# Altium project LAUNCHXL-CC1310.PrjPcb (part 3 of 4)
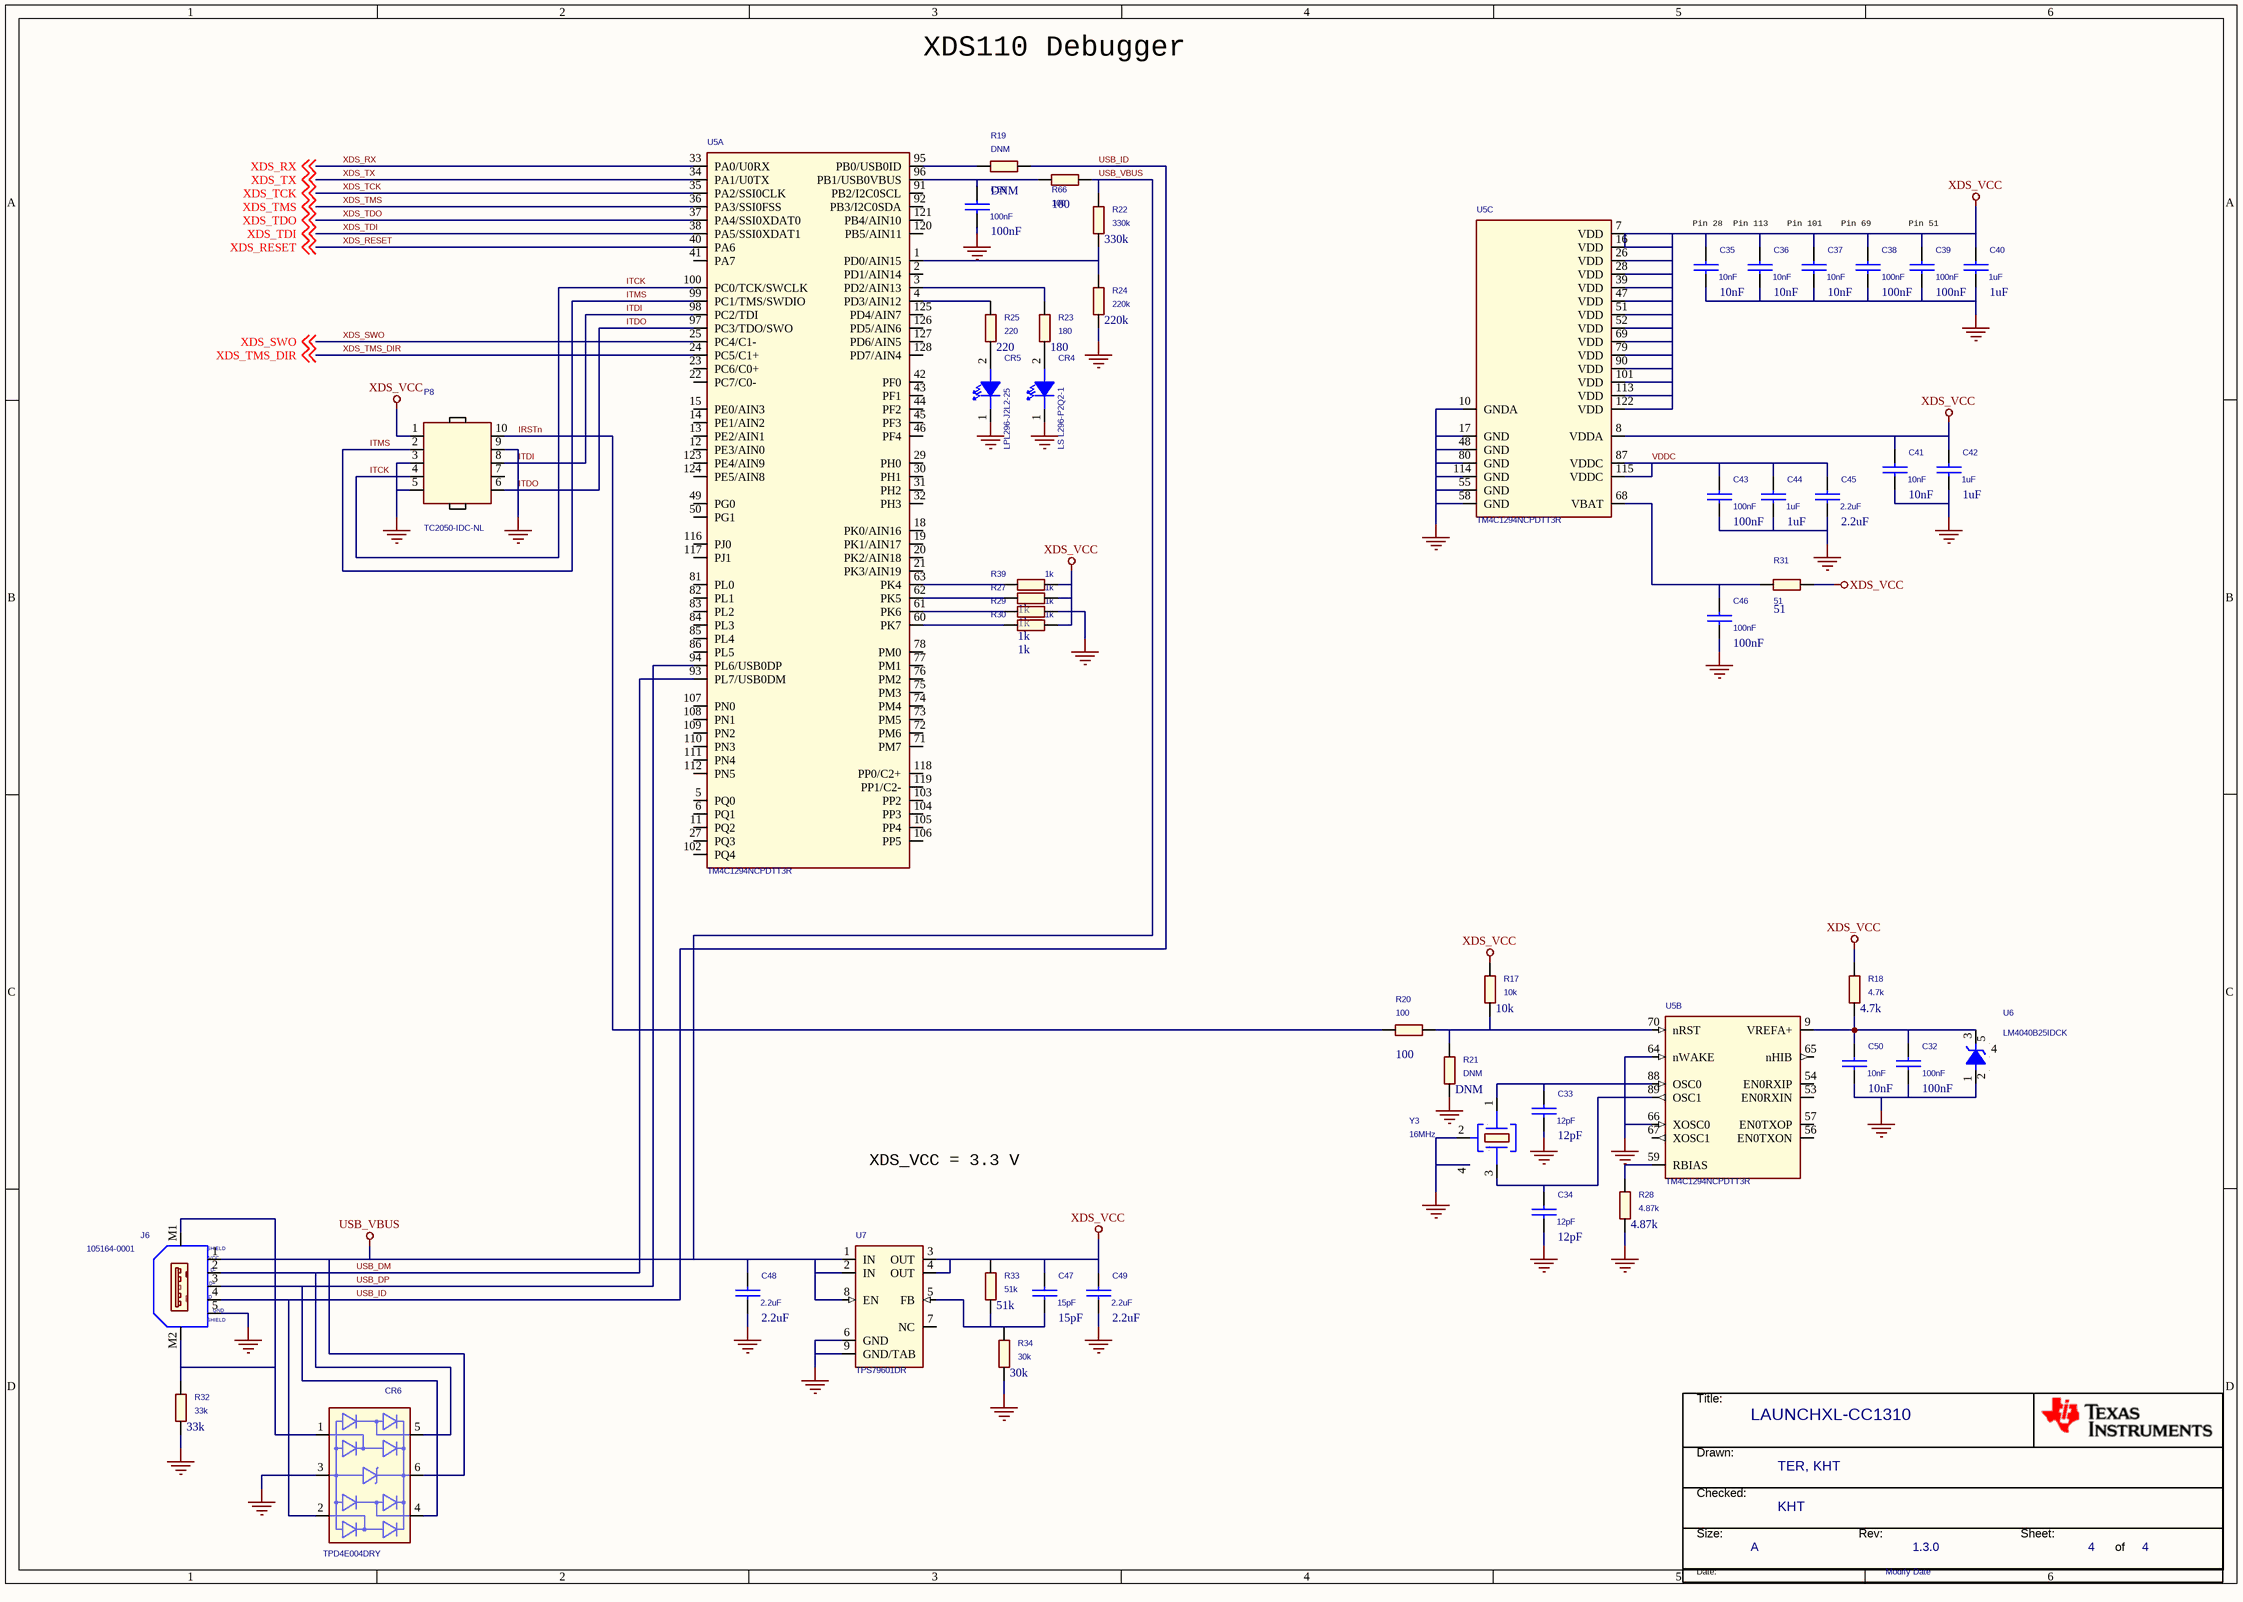
[diagram p4: 4_XDS110.SchDoc]

## Sheet 4_XDS110.SchDoc (continued)

### Library data of the parts
*#3 = TI_Norway_Title_Block_BMP: OrgName: Texas Instruments; Page Number: 4
C32 C38 C46 = CAPACITOR: CAPACITOR, CERAMIC X7R, 100nF, 6.3V, -10%/+10%, -55DEGC/+125DEGC, 0402, SMD; Vendor Part Status: NRND; Vendor Part Number: GRM155R70J104KA01D; MPN Status: ACTIVE; Part Number: 02-07610; VOLTAGE: CMAX; CURRENT: CIMAX; KNEE: CBMAX; PSpiceTemplate: C^@REFDES %1 %2 ?TOLERANCE|C^@REFDES| @VALUE ?IC/IC=@IC/ TC=@TC1,@TC2 ?TOLERANCE|\n.model C^@REFDES CAP C=1 DEV=@TOLERANCE%|; DIST: FLAT; SLOPE: CSMAX; MAX_TEMP: CTMAX; TC1: 0; Vendor: MURATA; BU Name: TEXAS INSTRUMENTS NORWAY; Packing Type: TAPE_&_REEL; Packing Size: 10000; Budget Currency: EUR; Budget Price: 0.007; Lead Time: 14; NOTE Status: PREFERRED; Min Tol: -10%; Max Tol: +10%; PCB Package: 0402; Old Footprint: CAPC1005X60N,0402; TC2: 0; Value: 100nF; Country of Origin: PHILIPPINES; Last Time Buy: N/A; AutoDoc File: https://notefied-dynamic-precision.com/DB/Apps/Desktop/Item/Object.aspx?id=113338; Datasheet URL 2: http://search.murata.co.jp/Ceramy/image/img/w_hinm/L0005E.pdf; Datasheet URL 1: http://psearch.murata.com/capacitor/product/GRM155R70J104KA01%23.pdf; WEIGHT: 0.0016g; LifeCycle Status: ACTIVE; RoHS Status: ROHS_COMPLIANT; MPN: GRM155R70J104KA01D; Manufacturer: MURATA; Dielectric Type: X7R; Capacitance: 100nF; Rtd Voltage: 6.3V; Min Oper Temp: -55DEGC; Max Oper Temp: +125DEGC; Part Type: CAPACITOR\CERAMIC\0402\STANDARD; Mounting Type: SMD; Revision: R000
C33 C34 = CAPACITOR: CAPACITOR, CERAMIC C0G/NP0, 12pF, 50V, -5%/+5%, -55DEGC/+125DEGC, 0402, SMD; Vendor Part Status: ACTIVE; Vendor Part Number: GRM1555C1H120JA01D; MPN: CAPACITOR_0402_12pF_C0G/NP0_M_+/-5%_50V; Manufacturer: MANUFACTURER SELECTION; Part Number: 02-07617; VOLTAGE: CMAX; CURRENT: CIMAX; KNEE: CBMAX; PSpiceTemplate: C^@REFDES %1 %2 ?TOLERANCE|C^@REFDES| @VALUE ?IC/IC=@IC/ TC=@TC1,@TC2 ?TOLERANCE|\n.model C^@REFDES CAP C=1 DEV=@TOLERANCE%|; DIST: FLAT; SLOPE: CSMAX; MAX_TEMP: CTMAX; TC1: 0; Vendor: MURATA; BU Name: TEXAS INSTRUMENTS NORWAY; Packing Type: TAPE_&_REEL; Packing Size: 10000; Definied Quality: INDUSTRIAL; Budget Currency: EUR; Budget Price: 0.007; Lead Time: 12; NOTE Status: PREFERRED; Min Tol: -5%; Max Tol: +5%; PCB Package: 0402; Old Footprint: CAPC1005X60N; TC2: 0; Value: 12pF; Country of Origin: PHILIPPINES; AutoDoc File: https://notefied-dynamic-precision.com/DB/Apps/Desktop/Item/Object.aspx?id=113345; Datasheet URL 2: http://search.murata.co.jp/Ceramy/image/img/w_hinm/L0005E.pdf; Datasheet URL 1: http://psearch.murata.com/capacitor/product/GRM1555C1H120JA01%23.pdf; MSL: N/A; MTBF Standard: N/A; MTBF: N/A; Esd Level: N/A; WEIGHT: 0.0016g; Last Time Buy: N/A; LifeCycle Status: ACTIVE; RoHS Status: ROHS_COMPLIANT; MPN Status: ACTIVE; Dielectric Type: C0G/NP0; Capacitance: 12pF; Rtd Voltage: 50V; Min Oper Temp: -55DEGC; Max Oper Temp: +125DEGC; Part Type: CAPACITOR\CERAMIC\0402\STANDARD; Mounting Type: SMD; Revision: R000
C35 C41 = CAPACITOR: CAPACITOR, CERAMIC X7R, 10nF, 25V, -10%/+10%, -55DEGC/+125DEGC, 0402, SMD; Vendor Part Status: ACTIVE; Vendor Part Number: CAPACITOR_0402_10nF_X7R_M_+/-10%_25V; Part Number: 02-07615; VOLTAGE: CMAX; CURRENT: CIMAX; KNEE: CBMAX; PSpiceTemplate: C^@REFDES %1 %2 ?TOLERANCE|C^@REFDES| @VALUE ?IC/IC=@IC/ TC=@TC1,@TC2 ?TOLERANCE|\n.model C^@REFDES CAP C=1 DEV=@TOLERANCE%|; DIST: FLAT; SLOPE: CSMAX; MAX_TEMP: CTMAX; TC1: 0; Vendor: MANUFACTURER SELECTION; BU Name: TEXAS INSTRUMENTS NORWAY; Packing Type: TAPE_&_REEL; Packing Size: 10000; Definied Quality: INDUSTRIAL; Budget Currency: USD; Budget Price: 0.00589; NOTE Status: PREFERRED; Min Tol: -10%; Max Tol: +10%; PCB Package: 0402; Old Footprint: CAPC1005X60N; TC2: 0; Value: 10nF; Country of Origin: MISSING INFO; AutoDoc File: https://notefied-dynamic-precision.com/DB/Apps/Desktop/Item/Object.aspx?id=113343; Datasheet URL 2: N/A; Datasheet URL 1: N/A; MSL: N/A; MTBF Standard: N/A; MTBF: N/A; Esd Level: N/A; WEIGHT: N/A; Last Time Buy: N/A; Lead Time: N/A; LifeCycle Status: ACTIVE; RoHS Status: ROHS_COMPLIANT; MPN Status: ACTIVE; MPN: CAPACITOR_0402_10nF_X7R_M_+/-10%_25V; Manufacturer: MANUFACTURER SELECTION; Dielectric Type: X7R; Capacitance: 10nF; Rtd Voltage: 25V; Min Oper Temp: -55DEGC; Max Oper Temp: +125DEGC; Part Type: CAPACITOR\CERAMIC\0402\STANDARD; Mounting Type: SMD; Revision: R000
C36 C37 C50 = CAPACITOR: CAPACITOR, CERAMIC X7R, 10nF, 25V, -10%/+10%, -55DEGC/+125DEGC, 0402, SMD; Vendor Part Status: ACTIVE; Vendor Part Number: CAPACITOR_0402_10nF_X7R_M_+/-10%_25V; Part Number: 02-07615; VOLTAGE: CMAX; CURRENT: CIMAX; KNEE: CBMAX; PSpiceTemplate: C^@REFDES %1 %2 ?TOLERANCE|C^@REFDES| @VALUE ?IC/IC=@IC/ TC=@TC1,@TC2 ?TOLERANCE|\n.model C^@REFDES CAP C=1 DEV=@TOLERANCE%|; DIST: FLAT; SLOPE: CSMAX; MAX_TEMP: CTMAX; TC1: 0; Vendor: MANUFACTURER SELECTION; BU Name: TEXAS INSTRUMENTS NORWAY; Old Footprint: CAPC1005X60N; PCB Package: 0402; Max Tol: +10%; Min Tol: -10%; NOTE Status: PREFERRED; Budget Price: 0.00589; Budget Currency: USD; Definied Quality: INDUSTRIAL; Packing Size: 10000; Packing Type: TAPE_&_REEL; TC2: 0; Value: 10nF; Country of Origin: MISSING INFO; Revision: R000; Mounting Type: SMD; Part Type: CAPACITOR\CERAMIC\0402\STANDARD; Max Oper Temp: +125DEGC; Min Oper Temp: -55DEGC; Rtd Voltage: 25V; Capacitance: 10nF; Dielectric Type: X7R; Manufacturer: MANUFACTURER SELECTION; MPN: CAPACITOR_0402_10nF_X7R_M_+/-10%_25V; MPN Status: ACTIVE; RoHS Status: ROHS_COMPLIANT; LifeCycle Status: ACTIVE; Lead Time: N/A; Last Time Buy: N/A; WEIGHT: N/A; Esd Level: N/A; MTBF: N/A; MTBF Standard: N/A; MSL: N/A; Datasheet URL 1: N/A; Datasheet URL 2: N/A; AutoDoc File: https://notefied-dynamic-precision.com/DB/Apps/Desktop/Item/Object.aspx?id=113343
C39 C43 = CAPACITOR: CAPACITOR, CERAMIC X7R, 100nF, 6.3V, -10%/+10%, -55DEGC/+125DEGC, 0402, SMD; Vendor Part Status: NRND; Vendor Part Number: GRM155R70J104KA01D; Part Number: 02-07610; MPN Status: ACTIVE; VOLTAGE: CMAX; CURRENT: CIMAX; KNEE: CBMAX; PSpiceTemplate: C^@REFDES %1 %2 ?TOLERANCE|C^@REFDES| @VALUE ?IC/IC=@IC/ TC=@TC1,@TC2 ?TOLERANCE|\n.model C^@REFDES CAP C=1 DEV=@TOLERANCE%|; DIST: FLAT; SLOPE: CSMAX; MAX_TEMP: CTMAX; TC1: 0; Vendor: MURATA; BU Name: TEXAS INSTRUMENTS NORWAY; Old Footprint: CAPC1005X60N,0402; PCB Package: 0402; Max Tol: +10%; Min Tol: -10%; NOTE Status: PREFERRED; Lead Time: 14; Budget Price: 0.007; Budget Currency: EUR; Packing Size: 10000; Packing Type: TAPE_&_REEL; TC2: 0; Value: 100nF; Country of Origin: PHILIPPINES; Last Time Buy: N/A; Revision: R000; Mounting Type: SMD; Part Type: CAPACITOR\CERAMIC\0402\STANDARD; Max Oper Temp: +125DEGC; Min Oper Temp: -55DEGC; Rtd Voltage: 6.3V; Capacitance: 100nF; Dielectric Type: X7R; Manufacturer: MURATA; MPN: GRM155R70J104KA01D; RoHS Status: ROHS_COMPLIANT; LifeCycle Status: ACTIVE; WEIGHT: 0.0016g; Datasheet URL 1: http://psearch.murata.com/capacitor/product/GRM155R70J104KA01%23.pdf; Datasheet URL 2: http://search.murata.co.jp/Ceramy/image/img/w_hinm/L0005E.pdf; AutoDoc File: https://notefied-dynamic-precision.com/DB/Apps/Desktop/Item/Object.aspx?id=113338
C40 C42 = CAPACITOR: CAPACITOR, CERAMIC X5R, 1uF, 10V, -10%/+10%, -55DEGC/+85DEGC, 0402, SMD; Vendor Part Status: NRND; Vendor Part Number: GRM155R61A105KE15D; Part Number: 02-07611; MPN Status: ACTIVE; VOLTAGE: CMAX; CURRENT: CIMAX; KNEE: CBMAX; PSpiceTemplate: C^@REFDES %1 %2 ?TOLERANCE|C^@REFDES| @VALUE ?IC/IC=@IC/ TC=@TC1,@TC2 ?TOLERANCE|\n.model C^@REFDES CAP C=1 DEV=@TOLERANCE%|; DIST: FLAT; SLOPE: CSMAX; MAX_TEMP: CTMAX; TC1: 0; Vendor: MURATA; BU Name: TEXAS INSTRUMENTS NORWAY; Old Footprint: CAPC1005X60N,0402; PCB Package: 0402; Max Tol: +10%; Min Tol: -10%; NOTE Status: PREFERRED; Lead Time: 12; Budget Price: 0.019; Budget Currency: EUR; Definied Quality: INDUSTRIAL; Packing Size: 10000; Packing Type: TAPE_&_REEL; TC2: 0; Value: 1uF; Country of Origin: PHILIPPINES,CHINA; Revision: R000; Mounting Type: SMD; Part Type: CAPACITOR\CERAMIC\0402\STANDARD; Max Oper Temp: +85DEGC; Min Oper Temp: -55DEGC; Rtd Voltage: 10V; Capacitance: 1uF; Dielectric Type: X5R; Manufacturer: MURATA; MPN: GRM155R61A105KE15D; RoHS Status: ROHS_COMPLIANT; Last Time Buy: N/A; WEIGHT: 0.0016g; Esd Level: N/A; MTBF: N/A; MTBF Standard: N/A; MSL: 1; Datasheet URL 1: http://psearch.murata.com/capacitor/product/GRM155R61A105KE15%23.pdf; Datasheet URL 2: http://search.murata.co.jp/Ceramy/image/img/w_hinm/L0005E.pdf; AutoDoc File: https://notefied-dynamic-precision.com/DB/Apps/Desktop/Item/Object.aspx?id=113339
C44 = CAPACITOR: CAPACITOR, CERAMIC X5R, 1uF, 10V, -10%/+10%, -55DEGC/+85DEGC, 0402, SMD; Vendor Part Status: NRND; Vendor Part Number: GRM155R61A105KE15D; MPN Status: ACTIVE; Part Number: 02-07611; VOLTAGE: CMAX; CURRENT: CIMAX; KNEE: CBMAX; PSpiceTemplate: C^@REFDES %1 %2 ?TOLERANCE|C^@REFDES| @VALUE ?IC/IC=@IC/ TC=@TC1,@TC2 ?TOLERANCE|\n.model C^@REFDES CAP C=1 DEV=@TOLERANCE%|; DIST: FLAT; SLOPE: CSMAX; MAX_TEMP: CTMAX; TC1: 0; Vendor: MURATA; BU Name: TEXAS INSTRUMENTS NORWAY; Packing Type: TAPE_&_REEL; Packing Size: 10000; Definied Quality: INDUSTRIAL; Budget Currency: EUR; Budget Price: 0.019; Lead Time: 12; NOTE Status: PREFERRED; Min Tol: -10%; Max Tol: +10%; PCB Package: 0402; Old Footprint: CAPC1005X60N,0402; TC2: 0; Value: 1uF; Country of Origin: PHILIPPINES,CHINA; AutoDoc File: https://notefied-dynamic-precision.com/DB/Apps/Desktop/Item/Object.aspx?id=113339; Datasheet URL 2: http://search.murata.co.jp/Ceramy/image/img/w_hinm/L0005E.pdf; Datasheet URL 1: http://psearch.murata.com/capacitor/product/GRM155R61A105KE15%23.pdf; MSL: 1; MTBF Standard: N/A; MTBF: N/A; Esd Level: N/A; WEIGHT: 0.0016g; Last Time Buy: N/A; RoHS Status: ROHS_COMPLIANT; MPN: GRM155R61A105KE15D; Manufacturer: MURATA; Dielectric Type: X5R; Capacitance: 1uF; Rtd Voltage: 10V; Min Oper Temp: -55DEGC; Max Oper Temp: +85DEGC; Part Type: CAPACITOR\CERAMIC\0402\STANDARD; Mounting Type: SMD; Revision: R000
C45 C48 = CAPACITOR: CAPACITOR, CERAMIC X5R, 2.2uF, 6.3V, -10%/+10%, -55DEGC/+85DEGC, 0402, SMD; Vendor Part Status: NRND; Vendor Part Number: GRM155R60J225KE95D; Part Number: 02-07624; VOLTAGE: CMAX; CURRENT: CIMAX; KNEE: CBMAX; PSpiceTemplate: C^@REFDES %1 %2 ?TOLERANCE|C^@REFDES| @VALUE ?IC/IC=@IC/ TC=@TC1,@TC2 ?TOLERANCE|\n.model C^@REFDES CAP C=1 DEV=@TOLERANCE%|; DIST: FLAT; SLOPE: CSMAX; MAX_TEMP: CTMAX; TC1: 0; Vendor: MURATA; BU Name: TEXAS INSTRUMENTS NORWAY; Old Footprint: CAPC1005X60N; PCB Package: 0402; Max Tol: +10%; Min Tol: -10%; NOTE Status: PREFERRED; Budget Price: 0.0126; Budget Currency: USD; Definied Quality: INDUSTRIAL; Packing Size: 10000; Packing Type: TAPE_&_REEL; TC2: 0; Value: 2.2uF; Country of Origin: PHILIPPINES; LifeCycle Status: NRND; Revision: R000; Mounting Type: SMD; Part Type: CAPACITOR\CERAMIC\0402\STANDARD; Max Oper Temp: +85DEGC; Min Oper Temp: -55DEGC; Rtd Voltage: 6.3V; Capacitance: 2.2uF; Dielectric Type: X5R; Manufacturer: MURATA; MPN: GRM155R60J225KE95D; MPN Status: NRND; RoHS Status: ROHS_COMPLIANT; Lead Time: N/A; Last Time Buy: N/A; WEIGHT: 0.0016g; Esd Level: N/A; MTBF: N/A; MTBF Standard: N/A; MSL: 1; Datasheet URL 1: http://psearch.murata.com/capacitor/product/GRM155R60J225KE95%23.pdf; Datasheet URL 2: http://search.murata.co.jp/Ceramy/image/img/w_hinm/L0005E.pdf; AutoDoc File: https://notefied-dynamic-precision.com/DB/Apps/Desktop/Item/Object.aspx?id=113352
C47 = CAPACITOR: CAPACITOR, CERAMIC C0G/NP0, 15pF, 50V, -5%/+5%, -55DEGC/+125DEGC, 0402, SMD; Vendor Part Status: ACTIVE; Vendor Part Number: CAPACITOR_0402_15pF_C0G/NP0_M_+/-5%_50V; Part Number: 02-07613; VOLTAGE: CMAX; CURRENT: CIMAX; KNEE: CBMAX; PSpiceTemplate: C^@REFDES %1 %2 ?TOLERANCE|C^@REFDES| @VALUE ?IC/IC=@IC/ TC=@TC1,@TC2 ?TOLERANCE|\n.model C^@REFDES CAP C=1 DEV=@TOLERANCE%|; DIST: FLAT; SLOPE: CSMAX; MAX_TEMP: CTMAX; TC1: 0; Vendor: MANUFACTURER SELECTION; BU Name: TEXAS INSTRUMENTS NORWAY; Packing Type: TAPE_&_REEL; Packing Size: 10000; Definied Quality: INDUSTRIAL; Budget Currency: USD; Budget Price: 0.00589; NOTE Status: PREFERRED; Min Tol: -5%; Max Tol: +5%; PCB Package: 0402; Old Footprint: CAPC1005X60N; TC2: 0; Value: 15pF; Country of Origin: MISSING INFO; AutoDoc File: https://notefied-dynamic-precision.com/DB/Apps/Desktop/Item/Object.aspx?id=113341; Datasheet URL 2: N/A; Datasheet URL 1: N/A; MSL: N/A; MTBF Standard: N/A; MTBF: N/A; Esd Level: N/A; WEIGHT: N/A; Last Time Buy: N/A; Lead Time: N/A; LifeCycle Status: ACTIVE; RoHS Status: ROHS_COMPLIANT; MPN Status: ACTIVE; MPN: CAPACITOR_0402_15pF_C0G/NP0_M_+/-5%_50V; Manufacturer: MANUFACTURER SELECTION; Dielectric Type: C0G/NP0; Capacitance: 15pF; Rtd Voltage: 50V; Min Oper Temp: -55DEGC; Max Oper Temp: +125DEGC; Part Type: CAPACITOR\CERAMIC\0402\STANDARD; Mounting Type: SMD; Revision: R000
C49 = CAPACITOR: CAPACITOR, CERAMIC X5R, 2.2uF, 6.3V, -10%/+10%, -55DEGC/+85DEGC, 0402, SMD; Vendor Part Status: NRND; Vendor Part Number: GRM155R60J225KE95D; Part Number: 02-07624; VOLTAGE: CMAX; CURRENT: CIMAX; KNEE: CBMAX; PSpiceTemplate: C^@REFDES %1 %2 ?TOLERANCE|C^@REFDES| @VALUE ?IC/IC=@IC/ TC=@TC1,@TC2 ?TOLERANCE|\n.model C^@REFDES CAP C=1 DEV=@TOLERANCE%|; DIST: FLAT; SLOPE: CSMAX; MAX_TEMP: CTMAX; TC1: 0; Vendor: MURATA; BU Name: TEXAS INSTRUMENTS NORWAY; Packing Type: TAPE_&_REEL; Packing Size: 10000; Definied Quality: INDUSTRIAL; Budget Currency: USD; Budget Price: 0.0126; NOTE Status: PREFERRED; Min Tol: -10%; Max Tol: +10%; PCB Package: 0402; Old Footprint: CAPC1005X60N; TC2: 0; Value: 2.2uF; Country of Origin: PHILIPPINES; LifeCycle Status: NRND; AutoDoc File: https://notefied-dynamic-precision.com/DB/Apps/Desktop/Item/Object.aspx?id=113352; Datasheet URL 2: http://search.murata.co.jp/Ceramy/image/img/w_hinm/L0005E.pdf; Datasheet URL 1: http://psearch.murata.com/capacitor/product/GRM155R60J225KE95%23.pdf; MSL: 1; MTBF Standard: N/A; MTBF: N/A; Esd Level: N/A; WEIGHT: 0.0016g; Last Time Buy: N/A; Lead Time: N/A; RoHS Status: ROHS_COMPLIANT; MPN Status: NRND; MPN: GRM155R60J225KE95D; Manufacturer: MURATA; Dielectric Type: X5R; Capacitance: 2.2uF; Rtd Voltage: 6.3V; Min Oper Temp: -55DEGC; Max Oper Temp: +85DEGC; Part Type: CAPACITOR\CERAMIC\0402\STANDARD; Mounting Type: SMD; Revision: R000
C59 = CAPACITOR: CAPACITOR, CERAMIC X7R, 100nF, 10V, -10%/+10%, -55DEGC/+125DEGC, 0402, SMD; Vendor Part Status: ACTIVE; Vendor Part Number: CAPACITOR_0402_100nF_X7R_M_+/-10%_10V; Part Number: 02-07614; MPN: CAPACITOR_0402_10nF_X7R_M_+/-10%_25V; VOLTAGE: CMAX; CURRENT: CIMAX; KNEE: CBMAX; PSpiceTemplate: C^@REFDES %1 %2 ?TOLERANCE|C^@REFDES| @VALUE ?IC/IC=@IC/ TC=@TC1,@TC2 ?TOLERANCE|\n.model C^@REFDES CAP C=1 DEV=@TOLERANCE%|; DIST: FLAT; SLOPE: CSMAX; MAX_TEMP: CTMAX; TC1: 0; Vendor: MANUFACTURER SELECTION; BU Name: TEXAS INSTRUMENTS NORWAY; Old Footprint: CAPC1005X60N; PCB Package: 0402; Max Tol: +10%; Min Tol: -10%; NOTE Status: PREFERRED; Budget Price: 0.00589; Budget Currency: USD; Definied Quality: INDUSTRIAL; Packing Size: 10000; Packing Type: TAPE_&_REEL; TC2: 0; Value: 100nF; Country of Origin: MISSING INFO; Revision: R000; Mounting Type: SMD; Part Type: CAPACITOR\CERAMIC\0402\STANDARD; Max Oper Temp: +125DEGC; Min Oper Temp: -55DEGC; Rtd Voltage: 10V; Capacitance: 100nF; Dielectric Type: X7R; Manufacturer: MANUFACTURER SELECTION; MPN Status: ACTIVE; RoHS Status: ROHS_COMPLIANT; LifeCycle Status: ACTIVE; Lead Time: N/A; Last Time Buy: N/A; WEIGHT: N/A; Esd Level: N/A; MTBF: N/A; MTBF Standard: N/A; MSL: N/A; Datasheet URL 1: N/A; Datasheet URL 2: N/A; AutoDoc File: https://notefied-dynamic-precision.com/DB/Apps/Desktop/Item/Object.aspx?id=113342
CR4 = LED: OPTO, LED, SUPER RED COLOR, 630nm, 1.8V TO 2.3V, 0.06A, 0603, SMD; MPN Status: NRND; Manufacturer: OSRAM; Part Number: 15-01169; PPCB Recomendation: Inactive for new design [Alert:0001]; Esd Level: HBM 2kV; Packing Type: TAPE_&_REEL; Packing Size: 5000; Definied Quality: INDUSTRIAL; Budget Currency: USD; Budget Price: 0.089; Lead Time: 8; NOTE Status: PREFERRED; Min Oper Temp: -40DEGC; Max Oper Temp: +100DEGC; PCB Package: 0603; Old Footprint: LEDC1708X67N; ALT_SYMBOLS: LEDC1708X67L,LEDC1708X67M; FPLIST: LEDC1708X67N,LEDC1708X67L,LEDC1708X67M; AutoDoc File: http://notefied-dynamic-precision.com/DB/Apps/Desktop/Item/Object.aspx?id=88355; Datasheet URL 2: http://www.osram-os.com/Graphics/XPic5/00077119_0.pdf/LS%20L296%20-%20SMARTLED%200603.pdf; Datasheet URL 1: http://www.osram-os.com/osram_os/en/products/product-catalog/led-light-emitting-diodes/smartled-0603/ls-l296/index.jsp?search_result=%2fosram_os%2fen%2fsearch%2fadvanced_search.jsp%3faction%3ddosearch%26inp_searchterm_1%3dLS%2bL296-P2Q2-1%26website_name%3; MSL: 2; MTBF Standard: N/A; MTBF: N/A; WEIGHT: 0.002g; Last Time Buy: N/A; RoHS Status: ROHS_COMPLIANT; MPN: LS L296-P2Q2-1; Rtd Current: 0.06A; Rtd Voltage: 1.8V TO 2.3V; Part Type: OPTO\LED\0603; Mounting Type: SMD; Revision: R003
CR5 = LED: OPTO, LED, GREEN COLOR, 562nm, 0.02A, 0.08W, 0603, SMD; MPN Status: NRND; Manufacturer: OSRAM; Part Number: 15-01023; Esd Level: HBM 2kV; Packing Type: TAPE_&_REEL; Packing Size: 5000; Definied Quality: INDUSTRIAL; Budget Currency: USD; Budget Price: 0.1263; Lead Time: 8; NOTE Status: NOT_PREFERRED; Rtd Voltage: 2V; Min Oper Temp: -40DEGC; Max Oper Temp: +100DEGC; PCB Package: 0603; Old Footprint: LEDC1707X65N; ALT_SYMBOLS: LEDC1707X65L,LEDC1707X65M; FPLIST: LEDC1707X65N,LEDC1707X65L,LEDC1707X65M; AutoDoc File: http://notefied-dynamic-precision.com/DB/Apps/Desktop/Item/Object.aspx?id=81622; Datasheet URL 2: http://catalog.osram-os.com/jsp/download.jsp?rootPath=/media/&name=LP_L296.pdf&docPath=Graphics/00077128_0.pdf&url=/media//_en/Graphics/00077128_0.pdf; Datasheet URL 1: N/A; MSL: 2; MTBF Standard: N/A; MTBF: N/A; WEIGHT: 0.002g; Last Time Buy: N/A; RoHS Status: ROHS_COMPLIANT; MPN: LP L296-J2L2-25; Rtd Power: 0.08W; Rtd Current: 0.02A; Part Type: OPTO\LED\0603; Mounting Type: SMD; Revision: R003
CR6 = DIODE_TPD4E004_SON6: DIODE, PROTECTION, ESD ARRAY, 4 CHANNEL, 6V TO 8V, -40DEGC/+85DEGC, SON6, SMD; MPN Status: ACTIVE; MPN: TPD4E004DRYR; Manufacturer: TEXAS INSTRUMENTS; Part Number: 14-06172; Designed_By: Piotr Przystup; MTBF Standard: CL=60%,Ta=55degC,Tt=125degC,Ea=0.7eV; MTBF: 9.90*10^8; Esd Level: HBM 15kV; Packing Type: TAPE_&_REEL; Packing Size: 5000; Definied Quality: INDUSTRIAL; Budget Currency: USD; Budget Price: 0.22; Lead Time: 10; NOTE Status: PREFERRED; Rtd Voltage: 6V TO 8V; Old Footprint: SON50P100X145X60-6N,SON50P100X145X65-6N; ALT_SYMBOLS: SON50P100X145X65-6L,SON50P100X145X65-6M; FPLIST: SON50P100X145X60-6N,SON50P100X145X65-6N,SON50P100X145X65-6L,SON50P100X145X65-6M; Designed_Date: 2014-05-13; AutoDoc File: http://notefied-dynamic-precision.com/DB/Apps/Desktop/Item/Object.aspx?id=96191; Datasheet URL 2: http://www.ti.com/lit/ds/symlink/tpd4e004.pdf; Datasheet URL 1: http://www.ti.com/lit/ml/mpds221e/mpds221e.pdf; MSL: 1; WEIGHT: 0.0028462g; Last Time Buy: N/A; RoHS Status: ROHS_COMPLIANT; Min Oper Temp: -40DEGC; Max Oper Temp: +85DEGC; Part Type: DIODE\PROTECTION; Mounting Type: SMD; PCB Package: SON6; Revision: R002
J6 = CONN_USB_MICRO_B_2MH: CONNECTOR, USB, FEMALE, RIGHT ANGLE, 1 ROW, 5 PINS, PITCH 0.65mm, SMD; MPN Status: ACTIVE; Manufacturer: MOLEX; Part Number: 06-04998; Designed_By: Artur Bielinski; CLASS: IO; Packing Type: TAPE_&_REEL; NOTE Status: PREFERRED; No Of Rows: 1; No Of Pos: 5; Rtd Current: 1.8V; Rtd Voltage: 30V; Min Oper Temp: -30DEGC; Max Oper Temp: +85DEGC; ALT_SYMBOLS: MOLEX_1051640001_A2L,MOLEX_1051640001_A2M; FPLIST: MOLEX_1051640001_A2N,MOLEX_1051640001_A2L,MOLEX_1051640001_A2M; Design_Date: 2015-03-31; AutoDoc File: http://notefied-dynamic-precision.com/DB/Apps/Desktop/Item/Object.aspx?id=104390; Datasheet URL 2: http://www.molex.com/webdocs/datasheets/pdf/en-us/1051640001_IO_CONNECTORS.pdf; Datasheet URL 1: http://www.molex.com/pdm_docs/sd/1051640001_sd.pdf; WEIGHT: 0.234g; RoHS Status: ROHS_COMPLIANT; MPN: 105164-0001; Pitch: 0.65mm; Part Type: CONNECTOR\USB\MICRO_USB-B; Mounting Type: SMD; Old Footprint: MOLEX_1051640001_A2N; Revision: R001
P8 = CONN_IDC_TC2050-IDC-NL: NON COMPONENT, CONNECTOR CABLE, PLUG OF NAILS, 10 PINS, 2 ROWS, SMD; Part Number: 19-00452; FPLIST: TAGCONNECT_TC2050IDCNLN,TAGCONNECT_TC2050IDCNLL,TAGCONNECT_TC2050IDCNLM; ALT_SYMBOLS: TAGCONNECT_TC2050IDCNLL,TAGCONNECT_TC2050IDCNLM; Revision: R001; Old Footprint: TAGCONNECT_TC2050IDCNLN; Part Type: NON_COMPONENT\CONNECTOR; AutoDoc File: http://notefied-dynamic-precision.com/DB/Apps/Desktop/Item/Object.aspx?id=96644
R17 = RESISTOR: RESISTOR, THICK FILM, 10k, -5%/+5%, 0.063W, 50V, -55DEGC/+155DEGC, 0402, SMD; Vendor Part Status: ACTIVE; Vendor Part Number: RESISTOR_0402_10k_+/-5%_50V_0.063W_M_+/-200ppm; Part Number: 01-22353; PSpiceTemplate: R^@REFDES %1 %2 ?TOLERANCE|R^@REFDES| @VALUE TC=@TC1,@TC2 ?TOLERANCE|\n.model R^@REFDES RES R=1 DEV=@TOLERANCE%|; VOLTAGE: RVMAX; DIST: FLAT; MAX_TEMP: RTMAX; TC1: 0; POWER: RMAX; Vendor: MANUFACTURER SELECTION; BU Name: TEXAS INSTRUMENTS NORWAY; Packing Type: TAPE_&_REEL; Packing Size: 10000; Definied Quality: INDUSTRIAL; Budget Currency: USD; Budget Price: 0.00244; NOTE Status: PREFERRED; Min TC: -200PPM/DEGC; Max TC: +200PPM/DEGC; Min Tol: -5%; Max Tol: +5%; PCB Package: 0402; Old Footprint: RESC1005X40N; TC2: 0; Value: 10k; Country of Origin: MISSING INFO; AutoDoc File: https://notefied-dynamic-precision.com/DB/Apps/Desktop/Item/Object.aspx?id=113326; Datasheet URL 2: N/A; Datasheet URL 1: N/A; MSL: N/A; MTBF Standard: N/A; MTBF: N/A; Esd Level: N/A; WEIGHT: N/A; Last Time Buy: N/A; Lead Time: N/A; LifeCycle Status: ACTIVE; RoHS Status: ROHS_COMPLIANT; MPN Status: ACTIVE; MPN: RESISTOR_0402_10k_+/-5%_50V_0.063W_M_+/-200ppm; Manufacturer: MANUFACTURER SELECTION; Resistor Type: THICK FILM; Resistance: 10k; Rtd Power: 0.063W; Rtd Current: N/A; Rtd Voltage: 50V; Min Oper Temp: -55DEGC; Max Oper Temp: +155DEGC; Part Type: RESISTOR\0402\STANDARD; Mounting Type: SMD; Revision: R000
R18 = RESISTOR: RESISTOR, THICK FILM, 4.7k, -5%/+5%, 0.063W, 50V, -55DEGC/+155DEGC, 0402, SMD; Vendor Part Status: ACTIVE; Vendor Part Number: RESISTOR_0402_4.7k_+/-5%_50V_0.063W_M_+/-200ppm; Part Number: 01-22352; PSpiceTemplate: R^@REFDES %1 %2 ?TOLERANCE|R^@REFDES| @VALUE TC=@TC1,@TC2 ?TOLERANCE|\n.model R^@REFDES RES R=1 DEV=@TOLERANCE%|; VOLTAGE: RVMAX; DIST: FLAT; MAX_TEMP: RTMAX; TC1: 0; POWER: RMAX; Vendor: MANUFACTURER SELECTION; BU Name: TEXAS INSTRUMENTS NORWAY; Old Footprint: RESC1005X40N; PCB Package: 0402; Max Tol: +5%; Min Tol: -5%; Max TC: +200PPM/DEGC; Min TC: -200PPM/DEGC; NOTE Status: PREFERRED; Budget Price: 0.00244; Budget Currency: USD; Definied Quality: INDUSTRIAL; Packing Size: 10000; Packing Type: TAPE_&_REEL; TC2: 0; Value: 4.7k; Country of Origin: MISSING INFO; Revision: R000; Mounting Type: SMD; Part Type: RESISTOR\0402\STANDARD; Max Oper Temp: +155DEGC; Min Oper Temp: -55DEGC; Rtd Voltage: 50V; Rtd Current: N/A; Rtd Power: 0.063W; Resistance: 4.7k; Resistor Type: THICK FILM; Manufacturer: MANUFACTURER SELECTION; MPN: RESISTOR_0402_4.7k_+/-5%_50V_0.063W_M_+/-200ppm; MPN Status: ACTIVE; RoHS Status: ROHS_COMPLIANT; LifeCycle Status: ACTIVE; Lead Time: N/A; Last Time Buy: N/A; WEIGHT: N/A; Esd Level: N/A; MTBF: N/A; MTBF Standard: N/A; MSL: N/A; Datasheet URL 1: N/A; Datasheet URL 2: N/A; AutoDoc File: https://notefied-dynamic-precision.com/DB/Apps/Desktop/Item/Object.aspx?id=113325
R19 R21 = RESISTOR: RESISTOR, DO NOT MOUNT, 0402, SMD; Vendor Part Status: ACTIVE; Part Number: 01-22339; PSpiceTemplate: R^@REFDES %1 %2 ?TOLERANCE|R^@REFDES| @VALUE TC=@TC1,@TC2 ?TOLERANCE|\n.model R^@REFDES RES R=1 DEV=@TOLERANCE%|; VOLTAGE: RVMAX; DIST: FLAT; MAX_TEMP: RTMAX; TC1: 0; POWER: RMAX; BU Name: TEXAS INSTRUMENTS NORWAY; NOTE Status: PREFERRED; PCB Package: 0402; Old Footprint: RESC1005X40N,0402; TC2: 0; Value: DNM; Country of Origin: MISSING INFO; Vendor Part Number: DNM; Vendor: DO NOT MOUNT; AutoDoc File: https://notefied-dynamic-precision.com/DB/Apps/Desktop/Item/Object.aspx?id=113312; Datasheet URL 2: N/A; Datasheet URL 1: N/A; MSL: N/A; MTBF Standard: N/A; MTBF: N/A; Esd Level: N/A; WEIGHT: N/A; Packing Size: N/A; Last Time Buy: N/A; Budget Currency: N/A; Budget Price: N/A; Lead Time: N/A; LifeCycle Status: ACTIVE; RoHS Status: MISSING_INFO; MPN Status: ACTIVE; MPN: DNM; Manufacturer: DO NOT MOUNT; Resistor Type: THICK FILM; Resistance: N/A; Rtd Power: N/A; Rtd Current: N/A; Rtd Voltage: N/A; Min TC: N/A; Max TC: N/A; Min Tol: N/A; Max Tol: N/A; Min Oper Temp: N/A; Max Oper Temp: N/A; Part Type: RESISTOR\0402\STANDARD; Mounting Type: SMD; Revision: R000
R20 = RESISTOR: RESISTOR, THICK FILM, 100, -1%/+1%, 0.063W, 50V, -55DEGC/+155DEGC, 0402, SMD; Vendor Part Status: ACTIVE; Vendor Part Number: RESISTOR_0402_100_+/-1%_50V_0.063W_M_+/-100ppm; Part Number: 01-22357; PSpiceTemplate: R^@REFDES %1 %2 ?TOLERANCE|R^@REFDES| @VALUE TC=@TC1,@TC2 ?TOLERANCE|\n.model R^@REFDES RES R=1 DEV=@TOLERANCE%|; VOLTAGE: RVMAX; DIST: FLAT; MAX_TEMP: RTMAX; TC1: 0; POWER: RMAX; Vendor: MANUFACTURER SELECTION; BU Name: TEXAS INSTRUMENTS NORWAY; Old Footprint: RESC1005X40N; PCB Package: 0402; Max Tol: +1%; Min Tol: -1%; Max TC: +100PPM/DEGC; Min TC: -100PPM/DEGC; NOTE Status: PREFERRED; Budget Price: 0.00244; Budget Currency: USD; Definied Quality: INDUSTRIAL; Packing Size: 10000; Packing Type: TAPE_&_REEL; TC2: 0; Value: 100; Country of Origin: MISSING INFO; Rtd Current: N/A; Revision: R000; Mounting Type: SMD; Part Type: RESISTOR\0402\PRECISION; Max Oper Temp: +155DEGC; Min Oper Temp: -55DEGC; Rtd Voltage: 50V; Rtd Power: 0.063W; Resistance: 100; Resistor Type: THICK FILM; Manufacturer: MANUFACTURER SELECTION; MPN: RESISTOR_0402_100_+/-1%_50V_0.063W_M_+/-100ppm; MPN Status: ACTIVE; RoHS Status: ROHS_COMPLIANT; LifeCycle Status: ACTIVE; Lead Time: N/A; Last Time Buy: N/A; WEIGHT: N/A; Esd Level: N/A; MTBF: N/A; MTBF Standard: N/A; MSL: N/A; Datasheet URL 1: N/A; Datasheet URL 2: N/A; AutoDoc File: https://notefied-dynamic-precision.com/DB/Apps/Desktop/Item/Object.aspx?id=113330
R22 = RESISTOR: RESISTOR, THICK FILM, 330k, -1%/+1%, 0.063W, 50V, -55DEGC/+155DEGC, 0402, SMD; Vendor Part Status: ACTIVE; Vendor Part Number: RESISTOR_0402_330k_+/-1%_50V_0.063W_M_+/-100ppm; Part Number: 01-22362; PSpiceTemplate: R^@REFDES %1 %2 ?TOLERANCE|R^@REFDES| @VALUE TC=@TC1,@TC2 ?TOLERANCE|\n.model R^@REFDES RES R=1 DEV=@TOLERANCE%|; VOLTAGE: RVMAX; DIST: FLAT; MAX_TEMP: RTMAX; TC1: 0; POWER: RMAX; Vendor: MANUFACTURER SELECTION; BU Name: TEXAS INSTRUMENTS NORWAY; Old Footprint: RESC1005X40N; PCB Package: 0402; Max Tol: +1%; Min Tol: -1%; Max TC: +100PPM/DEGC; Min TC: -100PPM/DEGC; NOTE Status: PREFERRED; Budget Price: 0.00244; Budget Currency: USD; Definied Quality: INDUSTRIAL; Packing Size: 10000; Packing Type: TAPE_&_REEL; TC2: 0; Value: 330k; Country of Origin: MISSING INFO; Revision: R000; Mounting Type: SMD; Part Type: RESISTOR\0402\PRECISION; Max Oper Temp: +155DEGC; Min Oper Temp: -55DEGC; Rtd Voltage: 50V; Rtd Power: 0.063W; Resistance: 330k; Resistor Type: THICK FILM; Manufacturer: MANUFACTURER SELECTION; MPN: RESISTOR_0402_330k_+/-1%_50V_0.063W_M_+/-100ppm; MPN Status: ACTIVE; RoHS Status: ROHS_COMPLIANT; LifeCycle Status: ACTIVE; Lead Time: N/A; Last Time Buy: N/A; WEIGHT: N/A; Esd Level: N/A; MTBF: N/A; MTBF Standard: N/A; MSL: N/A; Datasheet URL 1: N/A; Datasheet URL 2: N/A; AutoDoc File: https://notefied-dynamic-precision.com/DB/Apps/Desktop/Item/Object.aspx?id=113335; Rtd Current: N/A
R23 = RESISTOR: RESISTOR, THICK FILM, 180, -5%/+5%, 0.063W, 50V, -55DEGC/+155DEGC, 0402, SMD; Vendor Part Status: ACTIVE; Vendor Part Number: RESISTOR_0402_180_+/-5%_50V_0.063W_M_+/-200ppm; Part Number: 01-22345; PSpiceTemplate: R^@REFDES %1 %2 ?TOLERANCE|R^@REFDES| @VALUE TC=@TC1,@TC2 ?TOLERANCE|\n.model R^@REFDES RES R=1 DEV=@TOLERANCE%|; VOLTAGE: RVMAX; DIST: FLAT; MAX_TEMP: RTMAX; TC1: 0; POWER: RMAX; Vendor: MANUFACTURER SELECTION; BU Name: TEXAS INSTRUMENTS NORWAY; Packing Type: TAPE_&_REEL; Packing Size: 10000; Definied Quality: INDUSTRIAL; Budget Currency: USD; Budget Price: 0.00244; NOTE Status: PREFERRED; Min TC: -200PPM/DEGC; Max TC: +200PPM/DEGC; Min Tol: -5%; Max Tol: +5%; PCB Package: 0402; Old Footprint: RESC1005X40N; TC2: 0; Value: 180; Country of Origin: MISSING INFO; AutoDoc File: https://notefied-dynamic-precision.com/DB/Apps/Desktop/Item/Object.aspx?id=113318; Datasheet URL 2: N/A; Datasheet URL 1: N/A; MSL: N/A; MTBF Standard: N/A; MTBF: N/A; Esd Level: N/A; WEIGHT: N/A; Last Time Buy: N/A; Lead Time: N/A; LifeCycle Status: ACTIVE; RoHS Status: ROHS_COMPLIANT; MPN Status: ACTIVE; MPN: RESISTOR_0402_180_+/-5%_50V_0.063W_M_+/-200ppm; Manufacturer: MANUFACTURER SELECTION; Resistor Type: THICK FILM; Resistance: 180; Rtd Power: 0.063W; Rtd Current: N/A; Rtd Voltage: 50V; Min Oper Temp: -55DEGC; Max Oper Temp: +155DEGC; Part Type: RESISTOR\0402\STANDARD; Mounting Type: SMD; Revision: R000
R24 = RESISTOR: RESISTOR, THICK FILM, 220k, -1%/+1%, 0.063W, 50V, -55DEGC/+155DEGC, 0402, SMD; Vendor Part Status: ACTIVE; Vendor Part Number: RESISTOR_0402_220k_+/-1%_50V_0.063W_M_+/-100ppm; Part Number: 01-22361; PSpiceTemplate: R^@REFDES %1 %2 ?TOLERANCE|R^@REFDES| @VALUE TC=@TC1,@TC2 ?TOLERANCE|\n.model R^@REFDES RES R=1 DEV=@TOLERANCE%|; VOLTAGE: RVMAX; DIST: FLAT; MAX_TEMP: RTMAX; TC1: 0; POWER: RMAX; Vendor: MANUFACTURER SELECTION; BU Name: TEXAS INSTRUMENTS NORWAY; Old Footprint: RESC1005X40N; PCB Package: 0402; Max Tol: +1%; Min Tol: -1%; Max TC: +100PPM/DEGC; Min TC: -100PPM/DEGC; NOTE Status: PREFERRED; Budget Price: 0.00244; Budget Currency: USD; Definied Quality: INDUSTRIAL; Packing Size: 10000; Packing Type: TAPE_&_REEL; TC2: 0; Value: 220k; Country of Origin: MISSING INFO; Revision: R000; Mounting Type: SMD; Part Type: RESISTOR\0402\PRECISION; Max Oper Temp: +155DEGC; Min Oper Temp: -55DEGC; Rtd Voltage: 50V; Rtd Power: 0.063W; Resistance: 220k; Resistor Type: THICK FILM; Manufacturer: MANUFACTURER SELECTION; MPN: RESISTOR_0402_220k_+/-1%_50V_0.063W_M_+/-100ppm; MPN Status: ACTIVE; RoHS Status: ROHS_COMPLIANT; LifeCycle Status: ACTIVE; Lead Time: N/A; Last Time Buy: N/A; WEIGHT: N/A; Esd Level: N/A; MTBF: N/A; MTBF Standard: N/A; MSL: N/A; Datasheet URL 1: N/A; Datasheet URL 2: N/A; AutoDoc File: https://notefied-dynamic-precision.com/DB/Apps/Desktop/Item/Object.aspx?id=113334; Rtd Current: N/A
R25 = RESISTOR: RESISTOR, THICK FILM, 220, -5%/+5%, 0.063W, 50V, -55DEGC/+155DEGC, 0402, SMD; Vendor Part Status: ACTIVE; Vendor Part Number: RESISTOR_0402_220_+/-5%_50V_0.063W_M_+/-200ppm; Part Number: 01-22346; PSpiceTemplate: R^@REFDES %1 %2 ?TOLERANCE|R^@REFDES| @VALUE TC=@TC1,@TC2 ?TOLERANCE|\n.model R^@REFDES RES R=1 DEV=@TOLERANCE%|; VOLTAGE: RVMAX; DIST: FLAT; MAX_TEMP: RTMAX; TC1: 0; POWER: RMAX; Vendor: MANUFACTURER SELECTION; BU Name: TEXAS INSTRUMENTS NORWAY; Packing Type: TAPE_&_REEL; Packing Size: 10000; Definied Quality: INDUSTRIAL; Budget Currency: USD; Budget Price: 0.00244; NOTE Status: PREFERRED; Min TC: -200PPM/DEGC; Max TC: +200PPM/DEGC; Min Tol: -5%; Max Tol: +5%; PCB Package: 0402; Old Footprint: RESC1005X40N; TC2: 0; Value: 220; Country of Origin: MISSING INFO; AutoDoc File: https://notefied-dynamic-precision.com/DB/Apps/Desktop/Item/Object.aspx?id=113319; Datasheet URL 2: N/A; Datasheet URL 1: N/A; MSL: N/A; MTBF Standard: N/A; MTBF: N/A; Esd Level: N/A; WEIGHT: N/A; Last Time Buy: N/A; Lead Time: N/A; LifeCycle Status: ACTIVE; RoHS Status: ROHS_COMPLIANT; MPN Status: ACTIVE; MPN: RESISTOR_0402_220_+/-5%_50V_0.063W_M_+/-200ppm; Manufacturer: MANUFACTURER SELECTION; Resistor Type: THICK FILM; Resistance: 220; Rtd Power: 0.063W; Rtd Current: N/A; Rtd Voltage: 50V; Min Oper Temp: -55DEGC; Max Oper Temp: +155DEGC; Part Type: RESISTOR\0402\STANDARD; Mounting Type: SMD; Revision: R000
R27 R30 R39 = RESISTOR: RESISTOR, THICK FILM, 1k, -5%/+5%, 0.063W, 50V, -55DEGC/+155DEGC, 0402, SMD; Vendor Part Status: ACTIVE; Vendor Part Number: RESISTOR_0402_1k_+/-5%_50V_0.063W_M_+/-200ppm; Part Number: 01-22349; PSpiceTemplate: R^@REFDES %1 %2 ?TOLERANCE|R^@REFDES| @VALUE TC=@TC1,@TC2 ?TOLERANCE|\n.model R^@REFDES RES R=1 DEV=@TOLERANCE%|; VOLTAGE: RVMAX; DIST: FLAT; MAX_TEMP: RTMAX; TC1: 0; POWER: RMAX; Vendor: MANUFACTURER SELECTION; BU Name: TEXAS INSTRUMENTS NORWAY; Old Footprint: RESC1005X40N; PCB Package: 0402; Max Tol: +5%; Min Tol: -5%; Max TC: +200PPM/DEGC; Min TC: -200PPM/DEGC; NOTE Status: PREFERRED; Budget Price: 0.00244; Budget Currency: USD; Definied Quality: INDUSTRIAL; Packing Size: 10000; Packing Type: TAPE_&_REEL; TC2: 0; Value: 1k; Country of Origin: MISSING INFO; Rtd Current: N/A; Revision: R000; Mounting Type: SMD; Part Type: RESISTOR\0402\STANDARD; Max Oper Temp: +155DEGC; Min Oper Temp: -55DEGC; Rtd Voltage: 50V; Rtd Power: 0.063W; Resistance: 1k; Resistor Type: THICK FILM; Manufacturer: MANUFACTURER SELECTION; MPN: RESISTOR_0402_1k_+/-5%_50V_0.063W_M_+/-200ppm; MPN Status: ACTIVE; RoHS Status: ROHS_COMPLIANT; LifeCycle Status: ACTIVE; Lead Time: N/A; Last Time Buy: N/A; WEIGHT: N/A; Esd Level: N/A; MTBF: N/A; MTBF Standard: N/A; MSL: N/A; Datasheet URL 1: N/A; Datasheet URL 2: N/A; AutoDoc File: https://notefied-dynamic-precision.com/DB/Apps/Desktop/Item/Object.aspx?id=113322
R28 = RESISTOR: RESISTOR, THICK FILM, 4.87k, -1%/+1%, 0.063W, 50V, -55DEGC/+155DEGC, 0402, SMD; Vendor Part Status: ACTIVE; Vendor Part Number: RESISTOR_0402_4.87k_+/-1%_50V_0.063W_M_+/-100ppm; Part Number: 01-22358; PSpiceTemplate: R^@REFDES %1 %2 ?TOLERANCE|R^@REFDES| @VALUE TC=@TC1,@TC2 ?TOLERANCE|\n.model R^@REFDES RES R=1 DEV=@TOLERANCE%|; VOLTAGE: RVMAX; DIST: FLAT; MAX_TEMP: RTMAX; TC1: 0; POWER: RMAX; Vendor: MANUFACTURER SELECTION; BU Name: TEXAS INSTRUMENTS NORWAY; Old Footprint: RESC1005X40N; PCB Package: 0402; Max Tol: +1%; Min Tol: -1%; Max TC: +100PPM/DEGC; Min TC: -100PPM/DEGC; NOTE Status: PREFERRED; Budget Price: 0.00244; Budget Currency: USD; Definied Quality: INDUSTRIAL; Packing Size: 10000; Packing Type: TAPE_&_REEL; TC2: 0; Value: 4.87k; Country of Origin: MISSING INFO; Rtd Current: N/A; Revision: R000; Mounting Type: SMD; Part Type: RESISTOR\0402\PRECISION; Max Oper Temp: +155DEGC; Min Oper Temp: -55DEGC; Rtd Voltage: 50V; Rtd Power: 0.063W; Resistance: 4.87k; Resistor Type: THICK FILM; Manufacturer: MANUFACTURER SELECTION; MPN: RESISTOR_0402_4.87k_+/-1%_50V_0.063W_M_+/-100ppm; MPN Status: ACTIVE; RoHS Status: ROHS_COMPLIANT; LifeCycle Status: ACTIVE; Lead Time: N/A; Last Time Buy: N/A; WEIGHT: N/A; Esd Level: N/A; MTBF: N/A; MTBF Standard: N/A; MSL: N/A; Datasheet URL 1: N/A; Datasheet URL 2: N/A; AutoDoc File: https://notefied-dynamic-precision.com/DB/Apps/Desktop/Item/Object.aspx?id=113331
R29 = RESISTOR: RESISTOR, THICK FILM, 1k, -5%/+5%, 0.063W, 50V, -55DEGC/+155DEGC, 0402, SMD; Vendor Part Status: ACTIVE; Vendor Part Number: RESISTOR_0402_1k_+/-5%_50V_0.063W_M_+/-200ppm; Part Number: 01-22349; PSpiceTemplate: R^@REFDES %1 %2 ?TOLERANCE|R^@REFDES| @VALUE TC=@TC1,@TC2 ?TOLERANCE|\n.model R^@REFDES RES R=1 DEV=@TOLERANCE%|; VOLTAGE: RVMAX; DIST: FLAT; MAX_TEMP: RTMAX; TC1: 0; POWER: RMAX; Vendor: MANUFACTURER SELECTION; BU Name: TEXAS INSTRUMENTS NORWAY; Packing Type: TAPE_&_REEL; Packing Size: 10000; Definied Quality: INDUSTRIAL; Budget Currency: USD; Budget Price: 0.00244; NOTE Status: PREFERRED; Min TC: -200PPM/DEGC; Max TC: +200PPM/DEGC; Min Tol: -5%; Max Tol: +5%; PCB Package: 0402; Old Footprint: RESC1005X40N; TC2: 0; Value: 1k; Country of Origin: MISSING INFO; Rtd Current: N/A; AutoDoc File: https://notefied-dynamic-precision.com/DB/Apps/Desktop/Item/Object.aspx?id=113322; Datasheet URL 2: N/A; Datasheet URL 1: N/A; MSL: N/A; MTBF Standard: N/A; MTBF: N/A; Esd Level: N/A; WEIGHT: N/A; Last Time Buy: N/A; Lead Time: N/A; LifeCycle Status: ACTIVE; RoHS Status: ROHS_COMPLIANT; MPN Status: ACTIVE; MPN: RESISTOR_0402_1k_+/-5%_50V_0.063W_M_+/-200ppm; Manufacturer: MANUFACTURER SELECTION; Resistor Type: THICK FILM; Resistance: 1k; Rtd Power: 0.063W; Rtd Voltage: 50V; Min Oper Temp: -55DEGC; Max Oper Temp: +155DEGC; Part Type: RESISTOR\0402\STANDARD; Mounting Type: SMD; Revision: R000
R31 = RESISTOR: RESISTOR, THICK FILM, 51, -5%/+5%, 0.063W, 50V, -55DEGC/+155DEGC, 0402, SMD; Vendor Part Status: ACTIVE; Vendor Part Number: RESISTOR_0402_51_+/-5%_50V_0.063W_M_+/-200ppm; Part Number: 01-22342; PSpiceTemplate: R^@REFDES %1 %2 ?TOLERANCE|R^@REFDES| @VALUE TC=@TC1,@TC2 ?TOLERANCE|\n.model R^@REFDES RES R=1 DEV=@TOLERANCE%|; VOLTAGE: RVMAX; DIST: FLAT; MAX_TEMP: RTMAX; TC1: 0; POWER: RMAX; Vendor: MANUFACTURER SELECTION; BU Name: TEXAS INSTRUMENTS NORWAY; Old Footprint: RESC1005X40N; PCB Package: 0402; Max Tol: +5%; Min Tol: -5%; Max TC: +200PPM/DEGC; Min TC: -200PPM/DEGC; NOTE Status: PREFERRED; Budget Price: 0.00244; Budget Currency: USD; Definied Quality: INDUSTRIAL; Packing Size: 10000; Packing Type: TAPE_&_REEL; TC2: 0; Value: 51; Country of Origin: MISSING INFO; Rtd Current: N/A; Revision: R000; Mounting Type: SMD; Part Type: RESISTOR\0402\STANDARD; Max Oper Temp: +155DEGC; Min Oper Temp: -55DEGC; Rtd Voltage: 50V; Rtd Power: 0.063W; Resistance: 51; Resistor Type: THICK FILM; Manufacturer: MANUFACTURER SELECTION; MPN: RESISTOR_0402_51_+/-5%_50V_0.063W_M_+/-200ppm; MPN Status: ACTIVE; RoHS Status: ROHS_COMPLIANT; LifeCycle Status: ACTIVE; Lead Time: N/A; Last Time Buy: N/A; WEIGHT: N/A; Esd Level: N/A; MTBF: N/A; MTBF Standard: N/A; MSL: N/A; Datasheet URL 1: N/A; Datasheet URL 2: N/A; AutoDoc File: https://notefied-dynamic-precision.com/DB/Apps/Desktop/Item/Object.aspx?id=113315
R32 = RESISTOR: RESISTOR, THICK FILM, 33k, -1%/+1%, 0.063W, 50V, -55DEGC/+155DEGC, 0402, SMD; Vendor Part Status: ACTIVE; Vendor Part Number: RESISTOR_0402_33k_+/-1%_50V_0.063W_M_+/-100ppm; Part Number: 01-22359; PSpiceTemplate: R^@REFDES %1 %2 ?TOLERANCE|R^@REFDES| @VALUE TC=@TC1,@TC2 ?TOLERANCE|\n.model R^@REFDES RES R=1 DEV=@TOLERANCE%|; VOLTAGE: RVMAX; DIST: FLAT; MAX_TEMP: RTMAX; TC1: 0; POWER: RMAX; Vendor: MANUFACTURER SELECTION; BU Name: TEXAS INSTRUMENTS NORWAY; Old Footprint: RESC1005X40N; PCB Package: 0402; Max Tol: +1%; Min Tol: -1%; Max TC: +100PPM/DEGC; Min TC: -100PPM/DEGC; NOTE Status: PREFERRED; Budget Price: 0.00244; Budget Currency: USD; Definied Quality: INDUSTRIAL; Packing Size: 10000; Packing Type: TAPE_&_REEL; TC2: 0; Value: 33k; Country of Origin: MISSING INFO; Rtd Current: N/A; Revision: R000; Mounting Type: SMD; Part Type: RESISTOR\0402\PRECISION; Max Oper Temp: +155DEGC; Min Oper Temp: -55DEGC; Rtd Voltage: 50V; Rtd Power: 0.063W; Resistance: 33k; Resistor Type: THICK FILM; Manufacturer: MANUFACTURER SELECTION; MPN: RESISTOR_0402_33k_+/-1%_50V_0.063W_M_+/-100PPM; MPN Status: ACTIVE; RoHS Status: ROHS_COMPLIANT; LifeCycle Status: ACTIVE; Lead Time: N/A; Last Time Buy: N/A; WEIGHT: N/A; Esd Level: N/A; MTBF: N/A; MTBF Standard: N/A; MSL: N/A; Datasheet URL 1: N/A; Datasheet URL 2: N/A; AutoDoc File: https://notefied-dynamic-precision.com/DB/Apps/Desktop/Item/Object.aspx?id=113332
R33 = RESISTOR: RESISTOR, THICK FILM, 51k, -5%/+5%, 0.063W, 50V, -55DEGC/+155DEGC, 0402, SMD; Vendor Part Status: ACTIVE; Vendor Part Number: RESISTOR_0402_51k_+/-5%_50V_0.063W_M_+/-200ppm; Part Number: 01-22355; PSpiceTemplate: R^@REFDES %1 %2 ?TOLERANCE|R^@REFDES| @VALUE TC=@TC1,@TC2 ?TOLERANCE|\n.model R^@REFDES RES R=1 DEV=@TOLERANCE%|; VOLTAGE: RVMAX; DIST: FLAT; MAX_TEMP: RTMAX; TC1: 0; POWER: RMAX; Vendor: MANUFACTURER SELECTION; BU Name: TEXAS INSTRUMENTS NORWAY; Packing Type: TAPE_&_REEL; Packing Size: 10000; Definied Quality: INDUSTRIAL; Budget Currency: USD; Budget Price: 0.00244; NOTE Status: PREFERRED; Min TC: -200PPM/DEGC; Max TC: +200PPM/DEGC; Min Tol: -5%; Max Tol: +5%; PCB Package: 0402; Old Footprint: RESC1005X40N; TC2: 0; Value: 51k; Country of Origin: MISSING INFO; AutoDoc File: https://notefied-dynamic-precision.com/DB/Apps/Desktop/Item/Object.aspx?id=113328; Datasheet URL 2: N/A; Datasheet URL 1: N/A; MSL: N/A; MTBF Standard: N/A; MTBF: N/A; Esd Level: N/A; WEIGHT: N/A; Last Time Buy: N/A; Lead Time: N/A; LifeCycle Status: ACTIVE; RoHS Status: ROHS_COMPLIANT; MPN Status: ACTIVE; MPN: RESISTOR_0402_51k_+/-5%_50V_0.063W_M_+/-200ppm; Manufacturer: MANUFACTURER SELECTION; Resistor Type: THICK FILM; Resistance: 51k; Rtd Power: 0.063W; Rtd Current: N/A; Rtd Voltage: 50V; Min Oper Temp: -55DEGC; Max Oper Temp: +155DEGC; Part Type: RESISTOR\0402\STANDARD; Mounting Type: SMD; Revision: R000
R34 = RESISTOR: RESISTOR, THICK FILM, 30k, -5%/+5%, 0.063W, 50V, -55DEGC/+155DEGC, 0402, SMD; Vendor Part Status: ACTIVE; Vendor Part Number: RESISTOR_0402_30k_+/-5%_50V_0.063W_M_+/-200ppm; Part Number: 01-22354; PSpiceTemplate: R^@REFDES %1 %2 ?TOLERANCE|R^@REFDES| @VALUE TC=@TC1,@TC2 ?TOLERANCE|\n.model R^@REFDES RES R=1 DEV=@TOLERANCE%|; VOLTAGE: RVMAX; DIST: FLAT; MAX_TEMP: RTMAX; TC1: 0; POWER: RMAX; Vendor: MANUFACTURER SELECTION; BU Name: TEXAS INSTRUMENTS NORWAY; Packing Type: TAPE_&_REEL; Packing Size: 10000; Definied Quality: INDUSTRIAL; Budget Currency: USD; Budget Price: 0.00244; NOTE Status: PREFERRED; Min TC: -200PPM/DEGC; Max TC: +200PPM/DEGC; Min Tol: -5%; Max Tol: +5%; PCB Package: 0402; Old Footprint: RESC1005X40N; TC2: 0; Value: 30k; Country of Origin: MISSING INFO; AutoDoc File: https://notefied-dynamic-precision.com/DB/Apps/Desktop/Item/Object.aspx?id=113327; Datasheet URL 2: N/A; Datasheet URL 1: N/A; MSL: N/A; MTBF Standard: N/A; MTBF: N/A; Esd Level: N/A; WEIGHT: N/A; Last Time Buy: N/A; Lead Time: N/A; LifeCycle Status: ACTIVE; RoHS Status: ROHS_COMPLIANT; MPN Status: ACTIVE; MPN: RESISTOR_0402_30k_+/-5%_50V_0.063W_M_+/-200ppm; Manufacturer: MANUFACTURER SELECTION; Resistor Type: THICK FILM; Resistance: 30k; Rtd Power: 0.063W; Rtd Current: N/A; Rtd Voltage: 50V; Min Oper Temp: -55DEGC; Max Oper Temp: +155DEGC; Part Type: RESISTOR\0402\STANDARD; Mounting Type: SMD; Revision: R000
R66 = RESISTOR: RESISTOR, THICK FILM, 100, -5%/+5%, 0.063W, 50V, -55DEGC/+155DEGC, 0402, SMD; Vendor Part Status: ACTIVE; Vendor Part Number: RESISTOR_0402_100_+/-5%_50V_0.063W_M_+/-200ppm; Part Number: 01-22343; PSpiceTemplate: R^@REFDES %1 %2 ?TOLERANCE|R^@REFDES| @VALUE TC=@TC1,@TC2 ?TOLERANCE|\n.model R^@REFDES RES R=1 DEV=@TOLERANCE%|; VOLTAGE: RVMAX; DIST: FLAT; MAX_TEMP: RTMAX; TC1: 0; POWER: RMAX; Vendor: MANUFACTURER SELECTION; BU Name: TEXAS INSTRUMENTS NORWAY; Old Footprint: RESC1005X40N; PCB Package: 0402; Max Tol: +5%; Min Tol: -5%; Max TC: +200PPM/DEGC; Min TC: -200PPM/DEGC; NOTE Status: PREFERRED; Budget Price: 0.00244; Budget Currency: USD; Definied Quality: INDUSTRIAL; Packing Size: 10000; Packing Type: TAPE_&_REEL; TC2: 0; Value: 100; Country of Origin: MISSING INFO; Revision: R000; Mounting Type: SMD; Part Type: RESISTOR\0402\STANDARD; Max Oper Temp: +155DEGC; Min Oper Temp: -55DEGC; Rtd Voltage: 50V; Rtd Current: N/A; Rtd Power: 0.063W; Resistance: 100; Resistor Type: THICK FILM; Manufacturer: MANUFACTURER SELECTION; MPN: RESISTOR_0402_100_+/-5%_50V_0.063W_M_+/-200ppm; MPN Status: ACTIVE; RoHS Status: ROHS_COMPLIANT; LifeCycle Status: ACTIVE; Lead Time: N/A; Last Time Buy: N/A; WEIGHT: N/A; Esd Level: N/A; MTBF: N/A; MTBF Standard: N/A; MSL: N/A; Datasheet URL 1: N/A; Datasheet URL 2: N/A; AutoDoc File: https://notefied-dynamic-precision.com/DB/Apps/Desktop/Item/Object.aspx?id=113316
U5 = IC_PROC_TM4C1294NCPDT_TQFP128: IC, MICROPROCESSOR, TIVA C SERIES MICROCONTROLLER, ARM CRTEX-M4, 2.97V TO 3.63V, TQFP128, SMD; MPN Status: ACTIVE; Manufacturer: TEXAS INSTRUMENTS; Part Number: 18-29511; Designed_By: Artur Bielinski; SPLIT_INST: TRUE; SWAP_INFO: (S1+S2+S3); Packing Type: TAPE_&_REEL; Packing Size: 500; Budget Currency: USD; Budget Price: 8.47; NOTE Status: PREFERRED; Min Oper Temp: -40DEGC; Max Oper Temp: +85DEGC; ALT_SYMBOLS: QFP40P1600X1600X120-128L,QFP40P1600X1600X120-128M; FPLIST: QFP40P1600X1600X120-128N,QFP40P1600X1600X120-128L,QFP40P1600X1600X120-128M; CLASS: IC; Design_Date: 2014-07-04; AutoDoc File: http://notefied-dynamic-precision.com/DB/Apps/Desktop/Item/Object.aspx?id=96468; Datasheet URL 2: http://www.ti.com/lit/ds/symlink/tm4c1294ncpdt.pdf; Datasheet URL 1: N/A; MSL: 3; RoHS Status: ROHS_COMPLIANT; MPN: TM4C1294NCPDTT3R; Rtd Voltage: 2.97V TO 3.63V; Part Type: IC\PROCESSOR\TEXAS; Mounting Type: SMD; PCB Package: TQFP128; Old Footprint: QFP40P1600X1600X120-128N; Revision: R001
U6 = IC_REF_LM4040_SC70-5: IC, ANALOG, PRECISION MICROPOWER SHUNT VOLTAGE REFERENCE, 2.5V, SC70-5, SMD; MPN Status: ACTIVE; MPN: LM4040B25IDCKR; Manufacturer: TEXAS INSTRUMENTS; Part Number: 18-29558; Designed_By: Artur Bielinski; Packing Type: TAPE_&_REEL; Packing Size: 3000; Definied Quality: INDUSTRIAL; Budget Currency: USD; Budget Price: 0.78; Lead Time: 7; NOTE Status: PREFERRED; Min Oper Temp: -40DEGC; Max Oper Temp: +85DEGC; ALT_SYMBOLS: SOT65P210X110-5L,SOT65P210X110-5M; FPLIST: SOT65P210X110-5N,SOT65P210X110-5L,SOT65P210X110-5M; Design_Date: 2014-08-13; CLASS: IC; AutoDoc File: http://notefied-dynamic-precision.com/DB/Apps/Desktop/Item/Object.aspx?id=96645; Datasheet URL 2: http://www.ti.com/lit/ds/symlink/lm4040b25.pdf; Datasheet URL 1: http://www.ti.com/lit/ml/mpds025f/mpds025f.pdf; MSL: 1; Esd Level: N/A; WEIGHT: 0.011098173g; Last Time Buy: N/A; RoHS Status: ROHS_COMPLIANT; Rtd Voltage: 2.5V; Part Type: IC\ANALOG\PM\REFERENCE; Mounting Type: SMD; PCB Package: SC70-5; Old Footprint: SOT65P210X110-5N; Revision: R001
U7 = IC_PM_TPS79601_SON8: IC, ANALOG, ULTRALOW-NOISE, HIGH PSRR, FAST, RF, 1A LOW-DROPOUT LINEAR REGULATORS, VIN:2.7V TO 5.5V, VOUT:1.2V TO 5.5V, SON8, SMD; MPN Status: ACTIVE; MPN: TPS79601DRBR; Manufacturer: TEXAS INSTRUMENTS; Part Number: 18-29530; Designed_By: Artur Bielinski; Packing Type: TAPE_&_REEL; Packing Size: 3000; Budget Currency: USD; Budget Price: 1; NOTE Status: PREFERRED; Rtd Voltage: 1.2V TO 5.4V; Min Oper Temp: -40DEGC; Max Oper Temp: +125DEGC; Old Footprint: SON65P300X300X100-9AN; ALT_SYMBOLS: SON65P300X300X100-9AL,SON65P300X300X100-9AM; FPLIST: SON65P300X300X100-9AN,SON65P300X300X100-9AL,SON65P300X300X100-9AM; Design_Date: 2014-07-16; CLASS: IC; AutoDoc File: http://notefied-dynamic-precision.com/DB/Apps/Desktop/Item/Object.aspx?id=96546; Datasheet URL 2: http://www.ti.com/lit/ds/symlink/tps79601.pdf; Datasheet URL 1: http://www.ti.com/litv/pdf/mpds118j; MSL: 2; WEIGHT: 0.024660813g; LifeCycle Status: ACTIVE; RoHS Status: ROHS_COMPLIANT; Part Type: IC\ANALOG\PM\REGULATOR; Mounting Type: SMD; PCB Package: SON8; Revision: R001
Y3 = XTAL_4: CRYSTAL, OSCILLATOR, 16MHz, -30PPM/DEGC/+30PPM/DEGC, -40DEGC/+85DEGC, SMD; Part Number: 12-00745; Manufacturer: NIHON DEMPA KOGYO; MPN: NX3225GA-16.000M-STD-CRG-1; MPN Status: ACTIVE; FPLIST: OSCCC250X320X100-4BN,OSCCC250X320X100-4BL,OSCCC250X320X100-4BM; ALT_SYMBOLS: OSCCC250X320X100-4BL,OSCCC250X320X100-4BM; Max Tol: +20PPM; Min Tol: -20PPM; NOTE Status: PREFERRED; Revision: R001; Old Footprint: OSCCC250X320X100-4BN; Mounting Type: SMD; Part Type: CRYSTAL\OSCILLATOR; Max Oper Temp: +85DEGC; Min Oper Temp: -40DEGC; Max TC: +30PPM/DEGC; Min TC: -30PPM/DEGC; Frequency: 16MHz; RoHS Status: ROHS_COMPLIANT; Datasheet URL 1: N/A; Datasheet URL 2: http://www.ndk.com/images/products/catalog/c_NX3225GA-STD-CRG-2_e.pdf; AutoDoc File: http://notefied-dynamic-precision.com/DB/Apps/Desktop/Item/Object.aspx?id=96470